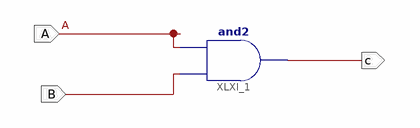
[diagram p0: schematic sheet 1]
// Xilinx ISE schematic zad1_schemat.sch (artix7) as structural Verilog: 1 symbols, 3 ports
module zad1_schemat (
  input  A,
  input  B,
  output c
);

  and XLXI_1 (c, B, A);
endmodule
